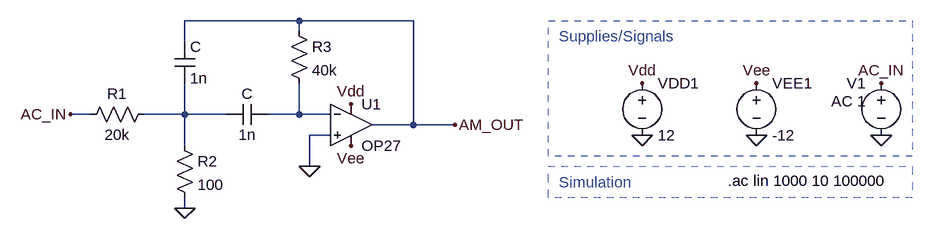
[diagram p0: schematic Draft5.asc]
Draft5.asc, the LTspice schematic file:
Version 4
SHEET 1 1332 680
WIRE 192 48 16 48
WIRE 368 48 192 48
WIRE 192 64 192 48
WIRE 16 80 16 48
WIRE -128 192 -160 192
WIRE 16 192 16 144
WIRE 16 192 -48 192
WIRE 80 192 16 192
WIRE 192 192 192 144
WIRE 192 192 144 192
WIRE 240 192 192 192
WIRE 368 208 368 48
WIRE 368 208 304 208
WIRE 432 208 368 208
WIRE 240 224 208 224
WIRE 16 240 16 192
WIRE 208 272 208 224
WIRE 16 336 16 320
FLAG 208 272 0
FLAG 272 176 Vdd
FLAG 272 240 Vee
FLAG 16 336 0
FLAG 432 208 AM_OUT
FLAG 1088 224 0
FLAG 1088 144 AC_IN
FLAG -160 192 AC_IN
FLAG 720 224 0
FLAG 896 224 0
FLAG 720 144 Vdd
FLAG 896 144 Vee
SYMBOL Opamps\\OP27 272 144 R0
SYMATTR InstName U1
SYMBOL res 176 48 R0
SYMATTR InstName R3
SYMATTR Value 40k
SYMBOL cap 0 80 R0
SYMATTR InstName C
SYMATTR Value 1n
SYMBOL res 0 224 R0
SYMATTR InstName R2
SYMATTR Value 100
SYMBOL res -32 176 R90
WINDOW 0 0 56 VBottom 2
WINDOW 3 32 56 VTop 2
SYMATTR InstName R1
SYMATTR Value 20k
SYMBOL cap 144 176 R90
WINDOW 0 0 32 VBottom 2
WINDOW 3 32 32 VTop 2
SYMATTR InstName C
SYMATTR Value 1n
SYMBOL voltage 1088 128 M0
WINDOW 3 210 96 Right 2
WINDOW 123 24 44 Left 2
WINDOW 39 0 0 Left 0
SYMATTR Value ""
SYMATTR Value2 AC 1
SYMATTR InstName V1
SYMBOL voltage 720 128 R0
SYMATTR InstName VDD1
SYMATTR Value 12
SYMBOL voltage 896 128 R0
SYMATTR InstName VEE1
SYMATTR Value -12
TEXT 852 294 Left 2 !.ac lin 1000 10 100000
TEXT 592 72 Left 2 ;Supplies/Signals
TEXT 592 296 Left 2 ;Simulation
RECTANGLE Normal 1136 256 576 48 2
RECTANGLE Normal 1136 320 576 272 2

The netlist it stands for:
* Draft5.asc
XU1 0 N002 Vdd Vee AM_OUT OP27  ; pins In+ In- V+ V- OUT
R3 AM_OUT N002 40k
C AM_OUT N001 1n
R2 N001 0 100
R1 N001 AC_IN 20k
C N002 N001 1n
V1 AC_IN 0 AC 1
VDD1 Vdd 0 12
VEE1 Vee 0 -12
.ac lin 1000 10 100000
* Supplies/Signals
* Simulation
.lib ADI.lib
.backanno
.end